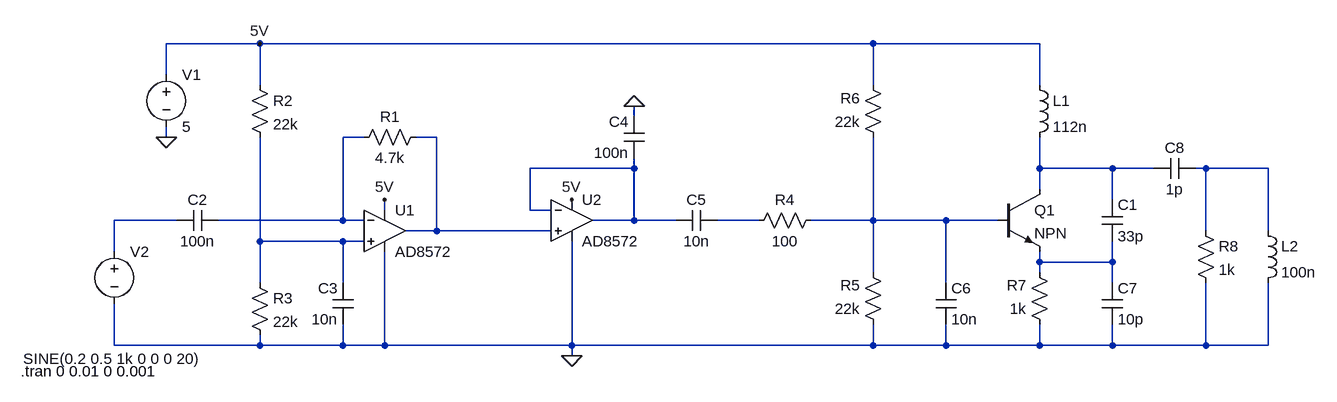
[diagram p0: schematic FM_transmitter.asc]
FM_transmitter.asc, the LTspice schematic file:
Version 4
SHEET 1 1672 680
WIRE -16 -144 -160 -144
WIRE 928 -144 -16 -144
WIRE 1184 -144 928 -144
WIRE -160 -96 -160 -144
WIRE -16 -80 -16 -144
WIRE 928 -80 928 -144
WIRE 1184 -80 1184 -144
WIRE 560 -32 560 -48
WIRE -160 0 -160 -16
WIRE 144 0 112 0
WIRE 256 0 224 0
WIRE 560 48 560 32
WIRE 560 48 400 48
WIRE 1184 48 1184 0
WIRE 1296 48 1184 48
WIRE 1360 48 1296 48
WIRE 1440 48 1424 48
WIRE 1536 48 1440 48
WIRE 1184 80 1184 48
WIRE 1296 96 1296 48
WIRE 176 112 176 96
WIRE 400 112 400 48
WIRE 432 112 400 112
WIRE -144 128 -240 128
WIRE 112 128 112 0
WIRE 112 128 -80 128
WIRE 144 128 112 128
WIRE 560 128 560 48
WIRE 560 128 496 128
WIRE 624 128 560 128
WIRE 752 128 688 128
WIRE 928 128 928 0
WIRE 928 128 832 128
WIRE 1040 128 928 128
WIRE 1120 128 1040 128
WIRE 256 144 256 0
WIRE 256 144 208 144
WIRE 432 144 256 144
WIRE 1440 144 1440 48
WIRE 1536 144 1536 48
WIRE -16 160 -16 0
WIRE 112 160 -16 160
WIRE 144 160 112 160
WIRE -240 176 -240 128
WIRE 1184 192 1184 176
WIRE 1296 192 1296 160
WIRE 1296 192 1184 192
WIRE 928 208 928 128
WIRE 1184 208 1184 192
WIRE -16 224 -16 160
WIRE 112 224 112 160
WIRE 1040 224 1040 128
WIRE 1296 224 1296 192
WIRE -240 320 -240 256
WIRE -16 320 -16 304
WIRE -16 320 -240 320
WIRE 112 320 112 288
WIRE 112 320 -16 320
WIRE 176 320 176 176
WIRE 176 320 112 320
WIRE 464 320 464 160
WIRE 464 320 176 320
WIRE 928 320 928 288
WIRE 928 320 464 320
WIRE 1040 320 1040 288
WIRE 1040 320 928 320
WIRE 1184 320 1184 288
WIRE 1184 320 1040 320
WIRE 1296 320 1296 288
WIRE 1296 320 1184 320
WIRE 1440 320 1440 224
WIRE 1440 320 1296 320
WIRE 1536 320 1536 224
WIRE 1536 320 1440 320
WIRE 464 336 464 320
FLAG 560 -48 0
FLAG 464 336 0
FLAG 176 96 5V
FLAG 464 96 5V
FLAG -16 -144 5V
FLAG -160 0 0
SYMBOL OpAmps\\AD8572 176 80 R0
SYMATTR InstName U1
SYMBOL OpAmps\\AD8572 464 64 R0
SYMATTR InstName U2
SYMBOL res 240 -16 R90
WINDOW 0 0 56 VBottom 2
WINDOW 3 32 56 VTop 2
SYMATTR InstName R1
SYMATTR Value 4.7k
SYMBOL res -32 -96 R0
SYMATTR InstName R2
SYMATTR Value 22k
SYMBOL res -32 208 R0
SYMATTR InstName R3
SYMATTR Value 22k
SYMBOL res 848 112 R90
WINDOW 0 0 56 VBottom 2
WINDOW 3 32 56 VTop 2
SYMATTR InstName R4
SYMATTR Value 100
SYMBOL res 944 304 R180
WINDOW 0 36 76 Left 2
WINDOW 3 36 40 Left 2
SYMATTR InstName R5
SYMATTR Value 22k
SYMBOL res 944 16 R180
WINDOW 0 36 76 Left 2
WINDOW 3 36 40 Left 2
SYMATTR InstName R6
SYMATTR Value 22k
SYMBOL res 1200 304 R180
WINDOW 0 36 76 Left 2
WINDOW 3 36 40 Left 2
SYMATTR InstName R7
SYMATTR Value 1k
SYMBOL cap -80 112 R90
WINDOW 0 0 32 VBottom 2
WINDOW 3 32 32 VTop 2
SYMATTR InstName C2
SYMATTR Value 100n
SYMBOL cap 128 288 R180
WINDOW 0 24 56 Left 2
WINDOW 3 24 8 Left 2
SYMATTR InstName C3
SYMATTR Value 10n
SYMBOL cap 576 32 R180
WINDOW 0 24 56 Left 2
WINDOW 3 24 8 Left 2
SYMATTR InstName C4
SYMATTR Value 100n
SYMBOL cap 624 144 R270
WINDOW 0 32 32 VTop 2
WINDOW 3 0 32 VBottom 2
SYMATTR InstName C5
SYMATTR Value 10n
SYMBOL cap 1024 224 R0
SYMATTR InstName C6
SYMATTR Value 10n
SYMBOL cap 1280 224 R0
SYMATTR InstName C7
SYMATTR Value 10p
SYMBOL cap 1424 32 R90
WINDOW 0 0 32 VBottom 2
WINDOW 3 32 32 VTop 2
SYMATTR InstName C8
SYMATTR Value 1p
SYMBOL npn 1120 80 R0
SYMATTR InstName Q1
SYMBOL ind 1168 -96 R0
SYMATTR InstName L1
SYMATTR Value 112n
SYMBOL res 1424 128 R0
SYMATTR InstName R8
SYMATTR Value 1k
SYMBOL voltage -160 -112 R0
WINDOW 123 0 0 Left 0
WINDOW 39 0 0 Left 0
SYMATTR InstName V1
SYMATTR Value 5
SYMBOL voltage -240 160 R0
WINDOW 3 -140 181 Left 2
WINDOW 123 0 0 Left 0
WINDOW 39 0 0 Left 0
SYMATTR Value SINE(0.2 0.5 1k 0 0 0 20)
SYMATTR InstName V2
SYMBOL ind 1520 128 R0
SYMATTR InstName L2
SYMATTR Value 100n
SYMBOL cap 1280 96 R0
SYMATTR InstName C1
SYMATTR Value 33p
TEXT -384 360 Left 2 !.tran 0 0.01 0 0.001

The netlist it stands for:
* FM_transmitter.asc
XU1 N009 N001 5V 0 N002 AD8572  ; pins In+ In- V+ V- OUT
XU2 N002 N003 5V 0 N003 AD8572  ; pins In+ In- V+ V- OUT
R1 N002 N001 4.7k
R2 5V N009 22k
R3 N009 0 22k
R4 N008 N007 100
R5 0 N008 22k
R6 N008 5V 22k
R7 0 N010 1k
C2 N001 N006 100n
C3 0 N009 10n
C4 N003 0 100n
C5 N003 N007 10n
C6 N008 0 10n
C7 N010 0 10p
C8 N005 N004 1p
Q1 N004 N008 N010 0 NPN
L1 5V N004 112n
R8 N005 0 1k
V1 5V 0 5
V2 N006 0 SINE(0.2 0.5 1k 0 0 0 20)
L2 N005 0 100n
C1 N004 N010 33p
.model NPN NPN
.model PNP PNP
.lib standard.bjt
.tran 0 0.01 0 0.001
.backanno
.end